# EAGLE design attiny45-musicbox (EAGLE 7.2.0)
CNAME: ATtiny45 Music Box; CREVISION: 0.1; DESIGNER: elm-chan mod by dru
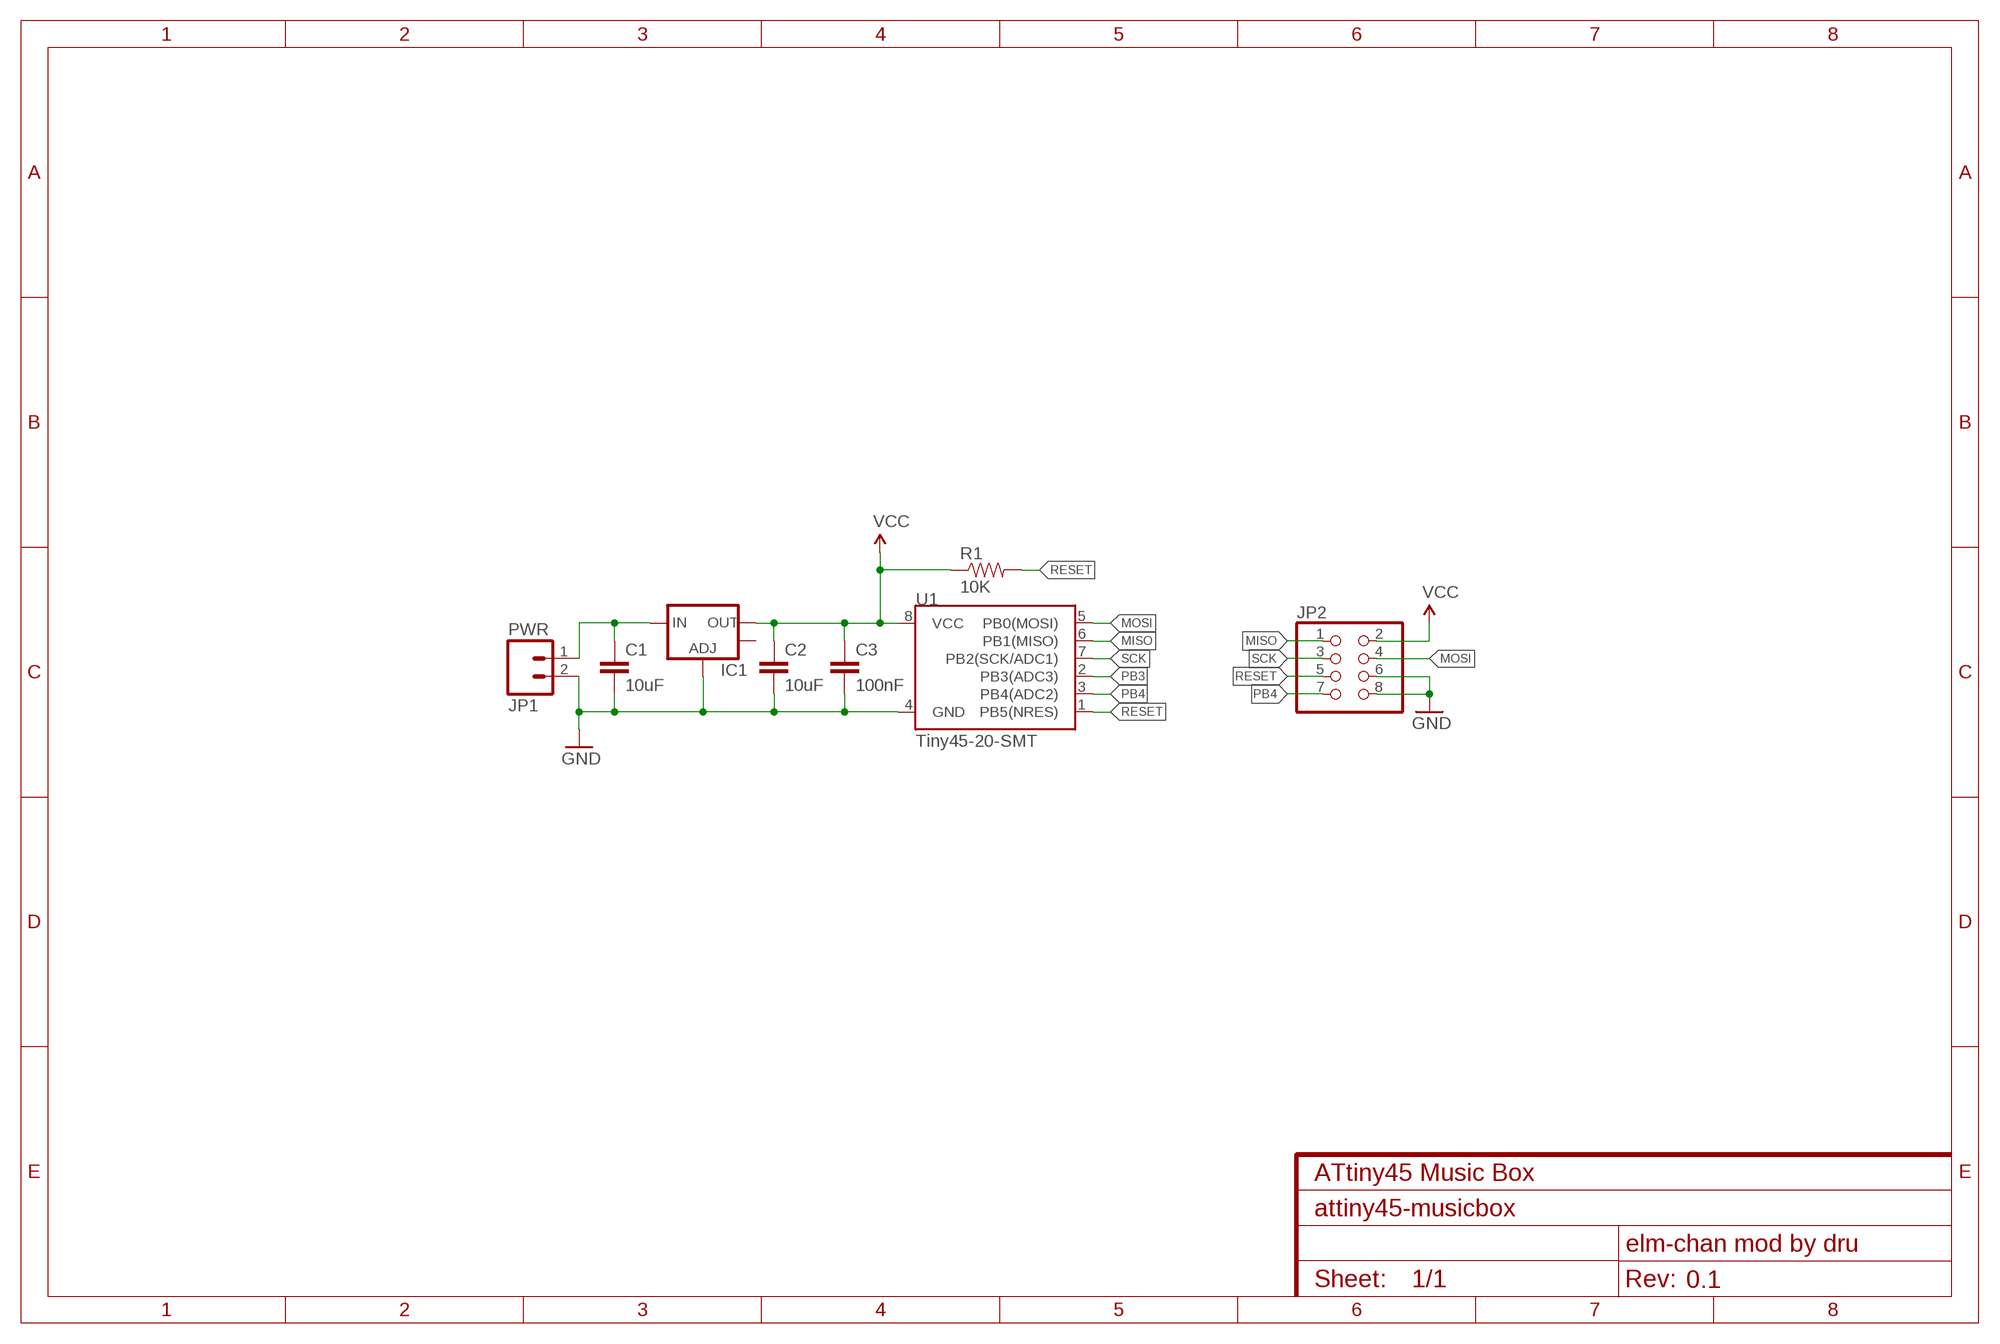
[diagram p0: schematic, sheet 1]

## Parts
C1  10uF  CAP0805  [0805]
C2  10uF  CAP0805  [0805]
C3  100nF  CAP0805  [0805]
IC1  V_REG_LM1117SOT223  [SOT223]
JP1  PWR  M02PTH  [1X02]
JP2  PINHD-2X4  [2X04]
R1  10K  RESISTOR0603-RES  [0603-RES]
U1  Tiny45-20-SMT  ATTINY45TINY45-20-SMT  [SO08-EIAJ]

## Nets
GND: C1.2 C2.2 C3.2 IC1.1(ADJ) JP1.2 JP2.6 JP2.8 U1.4(GND)
MISO: JP2.1 U1.6(PB1(MISO))
MOSI: JP2.4 U1.5(PB0(MOSI))
N$1: C1.1 IC1.3(IN) JP1.1
PB3: U1.2(PB3(ADC3))
PB4: JP2.7 U1.3(PB4(ADC2))
RESET: JP2.5 R1.2 U1.1(PB5(NRES))
SCK: JP2.3 U1.7(PB2(SCK/ADC1))
VCC: C2.1 C3.1 IC1.2(OUT) JP2.2 R1.1 U1.8(VCC)
Unconnected: IC1.4(OUT)

## Library data of the parts
C1-C3 = SparkFun-Capacitors:CAP: Capacitor Standard 0603 ceramic capacitor, and 0.1" leaded capacitor.
IC1 = SparkFun-PowerIC:V_REG_LM1117: Voltage Regulator LM1117 Standard adjustable voltage regulator but in SMD form. Spark Fun Electronics SKU : COM-00595
JP1 = SparkFun-Connectors:M02: Standard 2-pin 0.1" header. Use with - straight break away headers ( PRT-00116) - right angle break away headers (PRT-00553) - swiss pins (PRT-00743) - machine pins (PRT-00117) - female headers (PRT-00115) Molex polarized connector foot print use with: PRT-08233 with associated crimp pins and housings. 2.54_SCREWTERM for use with PRT-10571. 3.5mm Screw Terminal footprints for PRT-08084 5mm Screw Terminal footprints for use with PRT-08432
JP2 = adafruit:PINHD-2X4: PIN HEADER
R1 = SparkFun-Passives:RESISTOR: Resistor Basic schematic elements and footprints for 0603, 1206, and PTH resistors.
U1 = SparkFun-DigitalIC:ATTINY45: Atmel 8-pin 2/4/8kB flash uC; PROD_ID: IC-08922

## Board
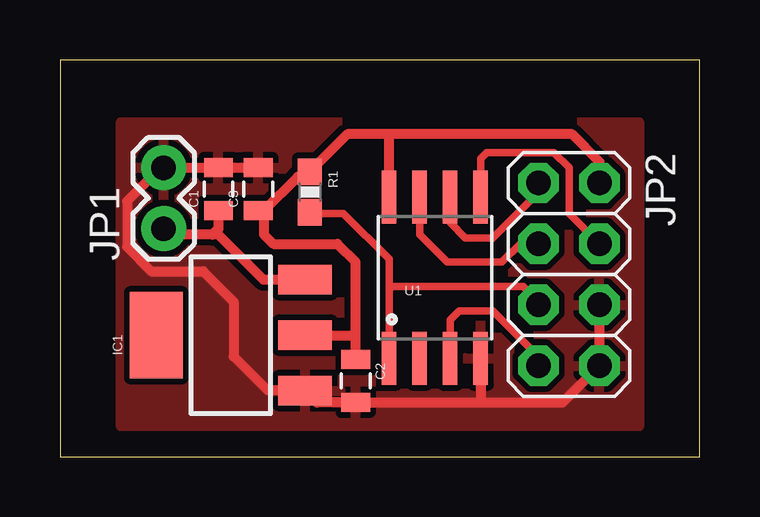
[diagram p1: board, top side]

Size 26.65 x 16.56 mm. Coordinates in mm from the lower left corner, seen from the top.
Outline: 0,0 26.65,0 26.65,16.56 0,16.56 0,0
Copper layers (1*16): Top 0.035mm / dielectric 1.5mm / Bottom 0.035mm
Design rules "default *": minimum track width 10mil, minimum drill 24mil, track to track 10mil, track to pad 10mil, pad to pad 10mil, via to via 8mil, smd to smd 8mil, copper to edge 40mil, drill to drill 8mil, minimum pad ring 10mil, minimum via ring 8mil, stop-mask expansion 4mil, vias tented up to drill 0mil, thermal gap 10mil

### Footprints (pad centres in the part's own frame; a part is rotated, then mirrored left to right if it is on the bottom)
0805 = smd 0.8 x 1.2: 1 -0.9,0; 2 0.9,0
SOT223 = smd 1.219 x 2.235: 1 -2.311,-3.099; 2 0,-3.099; 3 2.311,-3.099 | smd 3.6 x 2.2: 4 0,3.099
1X02 = drill 1.016 pad 1.88: 1 0,0; 2 2.54,0
2X04 = drill 1.016 pad 1.676 octagon: 1 -3.81,-1.27; 2 -3.81,1.27; 3 -1.27,-1.27; 4 -1.27,1.27; 5 1.27,-1.27; 6 1.27,1.27; 7 3.81,-1.27; 8 3.81,1.27
0603-RES = smd 1.1 x 1: 1 -0.85,0; 2 0.85,0
SO08-EIAJ = smd 0.61 x 2.21: 1 -1.905,-3.378; 2 -0.635,-3.378; 3 0.635,-3.378; 4 1.905,-3.378; 5 1.905,3.353; 6 0.635,3.353; 7 -0.635,3.353; 8 -1.905,3.353

### Placement (x,y rotation side)
C1  6.6,11.18 90 top
C2  12.32,3.17 270 top
C3  8.26,11.18 90 top
IC1  7.11,5.08 90 top
JP1  4.32,9.53 90 top
JP2  21.21,7.62 270 top
R1  10.41,11.05 270 top
U1  15.62,7.49 0 top

### Tracks (layer width: path | path; a pad name or v marks a point on that pad's centre or on a via)
GND
  Top 0.406: C3.2 C1.2 6.59,12.06 JP1.2 4.19,12.06 2.79,10.67 2.79,8.76 3.81,7.75 5.97,7.75 7.24,6.48 7.24,4.19 8.64,2.79 10.19,2.79 IC1.1 10.7,2.27 C2.2 17.65,2.27 | 17.65,2.27 20.94,2.27 JP2.8 JP2.6 | U1.4 17.53,2.4 17.65,2.27
  pour Top: 2.54,13.97 24.13,13.97 24.13,1.27 2.54,1.27
MISO
  Top 0.305: JP2.1 19.94,11.05 18.03,9.14 16.89,9.14 16.26,9.78 U1.6
MOSI
  Top 0.305: U1.5 17.53,12.45 17.78,12.7 20.57,12.7 21.21,12.06 21.21,10.16 JP2.4
N$1
  Top 0.406: IC1.3 8.48,7.39 6.6,9.27 6.35,9.27 | 6.35,9.27 4.57,9.27 JP1.1 | C1.1 6.6,9.53 6.35,9.27
PB4
  Top 0.305: U1.3 16.26,5.71 16.64,6.1 18.03,6.1 19.68,4.45 19.68,4.06 JP2.7
RESET
  Top 0.305: U1.1 13.72,6.99 | 13.72,6.99 13.72,8.26 11.81,10.16 10.45,10.16 R1.2 | JP2.5 19.94,6.48 19.3,7.11 13.84,7.11 13.72,6.99
SCK
  Top 0.305: JP2.3 19.18,8.89 18.41,8.13 16.13,8.13 14.99,9.27 U1.7
VCC
  Top 0.406: C3.1 8.5,10.28 | 8.5,10.28 9.91,11.68 10.2,11.68 R1.1 11.98,13.46 13.84,13.46 | 8.5,10.28 8.5,9.28 8.89,8.89 11.56,8.89 12.32,8.13 12.32,5.08 | C2.1 12.32,5.08 | IC1.2 12.32,5.08 | JP2.2 22.48,12.32 21.34,13.46 13.84,13.46 | U1.8 13.72,13.34 13.84,13.46

### Text on the board
Notes: Connect PB1 and PB4 to speaker